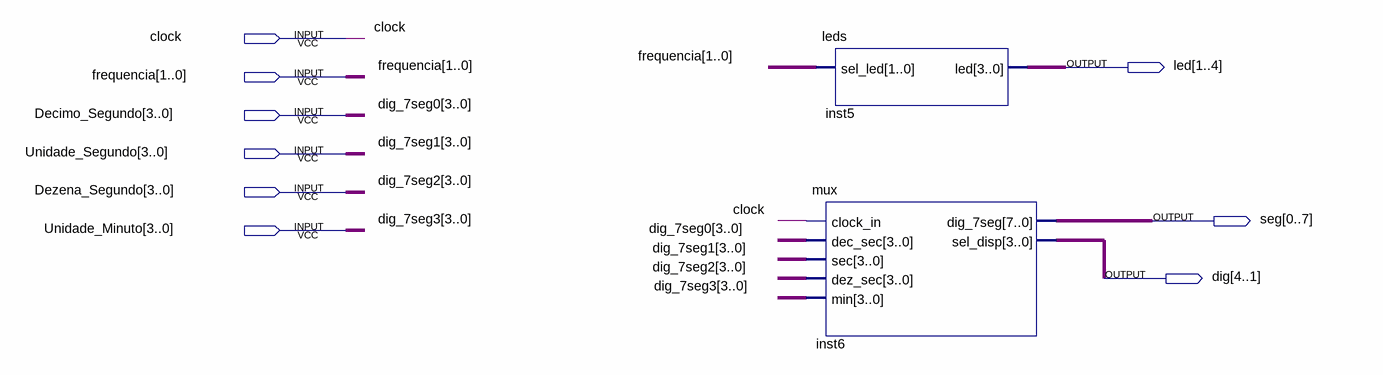
[diagram p0: schematic sheet]
// Quartus schematic display_led_bloco.bdf as structural Verilog: 2 symbols, 9 pins
module display_led_bloco (
  input  clock,
  input  [1:0] frequencia,
  input  [3:0] Decimo_Segundo,
  input  [3:0] Unidade_Segundo,
  input  [3:0] Dezena_Segundo,
  input  [3:0] Unidade_Minuto,
  output [1:4] led,
  output [0:7] seg,
  output [4:1] dig
);

  leds inst5 (.sel_led(frequencia), .led(led));
  mux inst6 (
    .clock_in(clock), .dec_sec(Decimo_Segundo), .sec(Unidade_Segundo), .dez_sec(Dezena_Segundo),
    .min(Unidade_Minuto), .dig_7seg(seg), .sel_disp(dig));

  // Other names for the same wires on the sheet: dig_7seg0[3:0] = Decimo_Segundo; dig_7seg1[3:0] = Unidade_Segundo;
  //   dig_7seg2[3:0] = Dezena_Segundo; dig_7seg3[3:0] = Unidade_Minuto
endmodule
